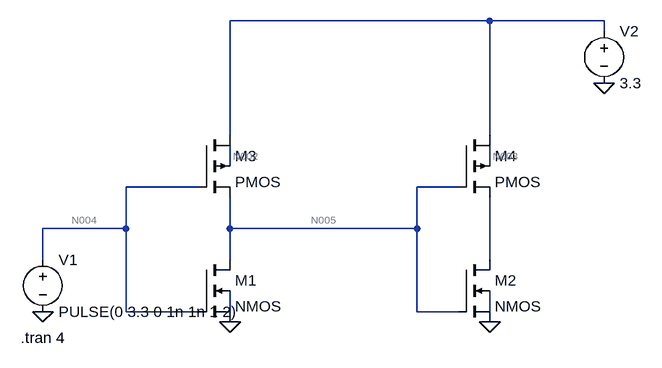
[diagram p0: schematic cmos_buffer.asc]
cmos_buffer.asc, the LTspice schematic file:
Version 4
SHEET 1 880 680
WIRE 592 -176 192 -176
WIRE 768 -176 592 -176
WIRE 768 -160 768 -176
WIRE 192 0 192 -176
WIRE 592 0 592 -176
WIRE 192 48 192 16
WIRE 592 48 592 16
WIRE 144 80 32 80
WIRE 544 80 480 80
WIRE 32 144 32 80
WIRE 32 144 -96 144
WIRE 192 144 192 96
WIRE 480 144 480 80
WIRE 480 144 192 144
WIRE -96 192 -96 144
WIRE 192 192 192 144
WIRE 592 192 592 96
WIRE 32 272 32 144
WIRE 144 272 32 272
WIRE 192 272 192 240
WIRE 480 272 480 144
WIRE 544 272 480 272
WIRE 592 272 592 240
FLAG -96 272 0
FLAG 192 288 0
FLAG 592 288 0
FLAG 768 -80 0
SYMBOL nmos4 144 192 R0
SYMATTR InstName M1
SYMBOL nmos4 544 192 R0
SYMATTR InstName M2
SYMBOL pmos4 144 0 R0
SYMATTR InstName M3
SYMBOL pmos4 544 0 R0
SYMATTR InstName M4
SYMBOL voltage -96 176 R0
WINDOW 123 0 0 Left 0
WINDOW 39 0 0 Left 0
SYMATTR InstName V1
SYMATTR Value PULSE(0 3.3 0 1n 1n 1 2)
SYMBOL voltage 768 -176 R0
SYMATTR InstName V2
SYMATTR Value 3.3
TEXT -130 312 Left 2 !.tran 4

The netlist it stands for:
* cmos_buffer.asc
M1 N005 N004 0 N007 NMOS
M2 N006 N005 0 N008 NMOS
M3 N001 N004 N005 N002 PMOS
M4 N001 N005 N006 N003 PMOS
V1 N004 0 PULSE(0 3.3 0 1n 1n 1 2)
V2 N001 0 3.3
.model NMOS NMOS
.model PMOS PMOS
.lib standard.mos
.tran 4
.backanno
.end

* Results of the author's LTspice run, read from the files saved beside the schematic
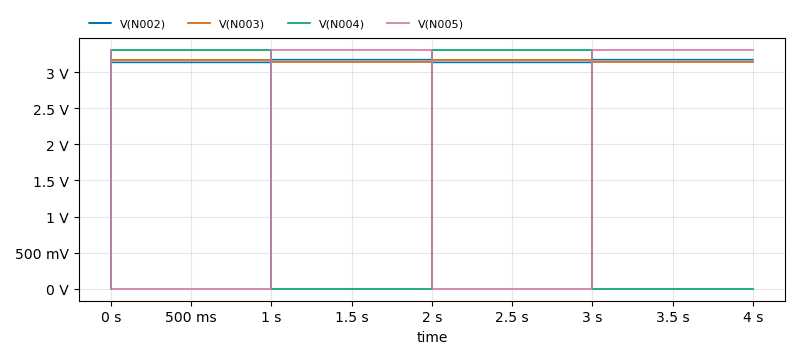
[diagram p1: Transient Analysis of cmos_buffer.asc, plotted from the saved traces]
* Transient Analysis, 1 run:
*   V(N002): min 3.134 V, max 3.171 V, average 3.152 V, rms 3.153 V, last 3.171 V
*   V(N003): min 3.134 V, max 3.171 V, average 3.153 V, rms 3.153 V, last 3.134 V
*   V(N004): min 0 V, max 3.3 V, average 1.65 V, rms 2.333 V, last 0 V
*   V(N005): min 0 V, max 3.3 V, average 1.65 V, rms 2.333 V, last 3.3 V